# Altium schematic sheet mcu.SchDoc
size A4; SheetNumber: 2; SheetTotal: 7
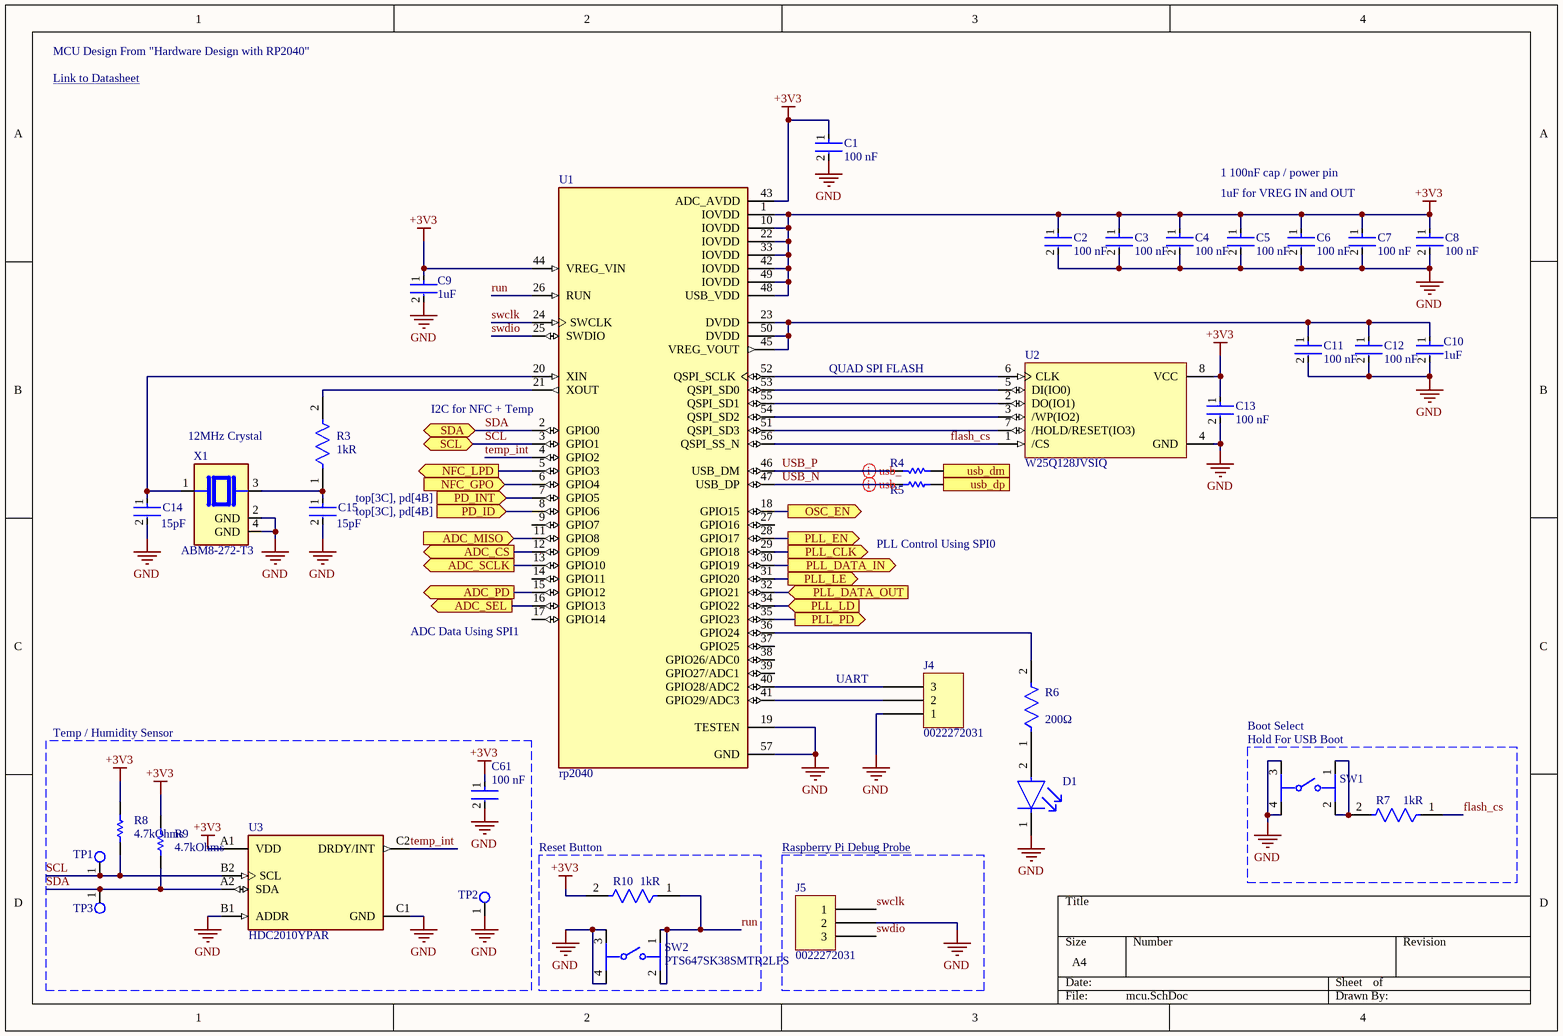
[diagram p0: mcu.SchDoc]

## Parts
C1  Capacitance: 100 nF  [FP-CC0603-DA-MFG]  (hidden comment: CC0603KRX7R7BB104)
C2  Capacitance: 100 nF  [FP-CC0603-DA-MFG]  (hidden comment: CC0603KRX7R7BB104)
C3  Capacitance: 100 nF  [FP-CC0603-DA-MFG]  (hidden comment: CC0603KRX7R7BB104)
C4  Capacitance: 100 nF  [FP-CC0603-DA-MFG]  (hidden comment: CC0603KRX7R7BB104)
C5  Capacitance: 100 nF  [FP-CC0603-DA-MFG]  (hidden comment: CC0603KRX7R7BB104)
C6  Capacitance: 100 nF  [FP-CC0603-DA-MFG]  (hidden comment: CC0603KRX7R7BB104)
C7  Capacitance: 100 nF  [FP-CC0603-DA-MFG]  (hidden comment: CC0603KRX7R7BB104)
C8  Capacitance: 100 nF  [FP-CC0603-DA-MFG]  (hidden comment: CC0603KRX7R7BB104)
C9  Capacitance: 1uF  [FP-CL10-IPC_C]  (hidden comment: CL10B105KP8NNNC)
C10  Capacitance: 1uF  [FP-CL10-IPC_C]  (hidden comment: CL10B105KP8NNNC)
C11  Capacitance: 100 nF  [FP-CC0603-DA-MFG]  (hidden comment: CC0603KRX7R7BB104)
C12  Capacitance: 100 nF  [FP-CC0603-DA-MFG]  (hidden comment: CC0603KRX7R7BB104)
C13  Capacitance: 100 nF  [FP-CC0603-DA-MFG]  (hidden comment: CC0603KRX7R7BB104)
C14  Capacitance: 15pF  [FP-GJM155-0_05-MFG]  (hidden comment: GJM1555C1H150GB01D)
C15  Capacitance: 15pF  [FP-GJM155-0_05-MFG]  (hidden comment: GJM1555C1H150GB01D)
C61  Capacitance: 100 nF  [FP-CC0603-DA-MFG]  (hidden comment: CC0603KRX7R7BB104)
D1  LTST-C190KRKT  [FP-LTST-C190KRKT-MFG]  (value not drawn)
J4  0022272031  [MOLEX KK 0022272031]
J5  0022272031  [MOLEX KK 0022272031]
R3  Resistance: 1kR  [FP-RC0603-0_55-IPC_C]  (hidden comment: RC0603FR-071KL)
R4  RC0402JR-0727RL  [RESC1005X40X25NL05T10]  (value not drawn)
R5  RC0402JR-0727RL  [RESC1005X40X25NL05T10]  (value not drawn)
R6  value 200Ω  [FP-RT0402-MFG]  (hidden comment: RT0402BRD07200RL)
R7  Resistance: 1kR  [FP-RC0603-0_55-IPC_C]  (hidden comment: RC0603FR-071KL)
R8  Resistance: 4.7kOhms  [RESC1608X55X25LL10T15]  (hidden comment: RC0603FR-074K7L)
R9  Resistance: 4.7kOhms  [RESC1608X55X25LL10T15]  (hidden comment: RC0603FR-074K7L)
R10  Resistance: 1kR  [FP-RC0603-0_55-IPC_C]  (hidden comment: RC0603FR-071KL)
SW1  PTS647SK38SMTR2LFS  [FP-PTS647SK38SMTR2LFS-MFG]  (value not drawn)
SW2  PTS647SK38SMTR2LFS  [FP-PTS647SK38SMTR2LFS-MFG]
TP1  Test Point  [test_point]  (value not drawn)
TP2  Test Point  [test_point]  (value not drawn)
TP3  Test Point  [test_point]  (value not drawn)
U1  rp2040  [QFN40P700X700X90-57N]
U2  W25Q128JVSIQ  [SOIC127P790X216-8N]
U3  HDC2010YPAR  [FP-YPA0006-MFG]
X1  ABM8-272-T3  [XTAL_ABM8-272-T3]

## Blocks framed on the sheet
Temp / Humidity Sensor: C61 R8 R9 TP1-TP3 U3
Reset Button: R10 SW2
Raspberry Pi Debug Probe: J5

## Ports
ADC_CS (out, see top[3C], measurment_iq[4B]), ADC_MISO (in, see top[3C], measurment_iq[4B]), ADC_PD (out, see top[3C], measurment_iq[4C]), ADC_SCLK (out, see top[3C], measurment_iq[4B]), ADC_SEL (out, see top[3C], measurment_iq[4C]), NFC_GPO (in, see top[3C], nfc[3B]), NFC_LPD (out, see top[3C], nfc[2B]), OSC_EN (out, see top[3B], measurment_synth[1B]), PD_ID (in, see top[3C], pd[4B]), PD_INT (in, see top[3C], pd[4B]), PLL_CLK (out, see top[3B], measurment_synth[2C]), PLL_DATA_IN (out, see top[3B], measurment_synth[2C]), PLL_DATA_OUT (in, see top[3B], measurment_synth[3C]), PLL_EN (out, see top[3B], measurment_synth[2B]), PLL_LD (in, see top[3B], measurment_synth[3B]), PLL_LE (out, see top[3B], measurment_synth[2C]), PLL_PD (out, see top[3B], measurment_synth[2B]), SCL (bidir, see top[3C], nfc[1B], pd[2C]), SDA (bidir, see top[3C], nfc[1B], pd[2C]), usb_dm (in, see top[3B]), usb_dp (in, see top[3B])

## Nets
+3V3: C1.1 C2.1 C3.1 C4.1 C5.1 C6.1 C7.1 C8.1 C9.1 C13.1 C61.1 R8.2 R9.2 R10.2 U1.1(IOVDD) U1.10(IOVDD) U1.22(IOVDD) U1.33(IOVDD) U1.42(IOVDD) U1.43(ADC_AVDD) U1.44(VREG_VIN) U1.48(USB_VDD) U1.49(IOVDD) U2.8(VCC) U3.A1(VDD)
GND: C1.2 C2.2 C3.2 C4.2 C5.2 C6.2 C7.2 C8.2 C9.2 C10.2 C11.2 C12.2 C13.2 C14.2 C15.2 C61.2 D1.1(C) J4.1 J5.2 SW1.3 SW1.4 SW2.3 SW2.4 TP2.1 U1.19(TESTEN) U1.57(GND) U2.4(GND) U3.B1(ADDR) U3.C1(GND) X1.2(GND) X1.4(GND)
ADC_CS: U1.12(GPIO9) ; port ADC_CS
ADC_MISO: U1.11(GPIO8) ; port ADC_MISO
ADC_PD: U1.15(GPIO12) ; port ADC_PD
ADC_SCLK: U1.13(GPIO10) ; port ADC_SCLK
ADC_SEL: U1.16(GPIO13) ; port ADC_SEL
flash_cs: R7.1 U1.56(QSPI_SS_N) U2.1(/CS)
NFC_GPO: U1.6(GPIO4) ; port NFC_GPO
NFC_LPD: U1.5(GPIO3) ; port NFC_LPD
OSC_EN: U1.18(GPIO15) ; port OSC_EN
PD_ID: U1.8(GPIO6) ; port PD_ID
PD_INT: U1.7(GPIO5) ; port PD_INT
PLL_CLK: U1.29(GPIO18) ; port PLL_CLK
PLL_DATA_IN: U1.30(GPIO19) ; port PLL_DATA_IN
PLL_DATA_OUT: U1.32(GPIO21) ; port PLL_DATA_OUT
PLL_EN: U1.28(GPIO17) ; port PLL_EN
PLL_LD: U1.34(GPIO22) ; port PLL_LD
PLL_LE: U1.31(GPIO20) ; port PLL_LE
PLL_PD: U1.35(GPIO23) ; port PLL_PD
run: R10.1 SW2.1 SW2.2 U1.26(RUN)
SCL: R8.1 TP1.1 U1.3(GPIO1) U3.B2(SCL) ; port SCL
SDA: R9.1 TP3.1 U1.2(GPIO0) U3.A2(SDA) ; port SDA
swclk: J5.1 U1.24(SWCLK)
swdio: J5.3 U1.25(SWDIO)
temp_int: U1.4(GPIO2) U3.C2(DRDY/INT)
usb_dm: R4.2 ; port usb_dm
usb_dp: R5.2 ; port usb_dp
USB_N: R5.1 U1.47(USB_DP)
USB_P: R4.1 U1.46(USB_DM)
NetC10_1: C10.1 C11.1 C12.1 U1.23(DVDD) U1.45(VREG_VOUT) U1.50(DVDD)
NetC14_1: C14.1 U1.20(XIN) X1.1
NetC15_1: C15.1 R3.1 X1.3
NetD1_2: D1.2(A) R6.1
NetJ4_2: J4.2 U1.41(GPIO29/ADC3)
NetJ4_3: J4.3 U1.40(GPIO28/ADC2)
NetR3_2: R3.2 U1.21(XOUT)
NetR6_2: R6.2 U1.36(GPIO24)
NetR7_2: R7.2 SW1.1 SW1.2
NetU1_51: U1.51(QSPI_SD3) U2.7(/HOLD/RESET(IO3))
NetU1_52: U1.52(QSPI_SCLK) U2.6(CLK)
NetU1_53: U1.53(QSPI_SD0) U2.5(DI(IO0))
NetU1_54: U1.54(QSPI_SD2) U2.3(/WP(IO2))
NetU1_55: U1.55(QSPI_SD1) U2.2(DO(IO1))

Not connected (* = marked no-connect by the designer): U1 9(GPIO7) 14(GPIO11) 17(GPIO14) 27(GPIO16) 37(GPIO25) 38(GPIO26/ADC0) 39(GPIO27/ADC1)

## Layout directives
differential pair: USB_N, USB_P

## Notes on the sheet
- MCU Design From "Hardware Design with RP2040"
- Link to Datasheet <https://datasheets.raspberrypi.com/rp2040/hardware-design-with-rp2040.pdf>
- 1 100nF cap / power pin
- 1uF for VREG IN and OUT
- QUAD SPI FLASH
- 12MHz Crystal
- (near U1) I2C for NFC + Temp
- PLL Control Using SPI0
- (near U1) ADC Data Using SPI1
- UART
- (near SW1) Hold For USB Boot
- Boot Select

## Library data of the parts
C1-C8 C11-C13 C61 = CMP-2000-05002-2: CAP CER 0.1UF 16V X7R 0603; Manufacturer: YAGEO; Tolerance: 0.1; Value: 100 nF; Temperature Coefficient: 15%; Material: Ceramic; Voltage Rating: 16 V; Package: CC0603-DA; ComponentLink2Description: Datasheet; Octopart: https://octopart.com/cc0603krx7r7bb104-yageo-192941; Temperature Range High: +125°C; Digikey Description: CAP CER 0.1UF 16V X7R 0603; Voltage: 16 V; Device Class L2: Capacitors; Height: 0.9mm; Temperature: -55°C to +125°C; Manufacturer Part Number: CC0603KRX7R7BB104; Device Class L1: Passive Components; Device Class L3: Ceramic Capacitors; ComponentLink2URL: http://www.yageo.com/documents/recent/UPY-GPHC_X7R_6.3V-to-50V_18.pdf; Footprint Url: http://www.yageo.com/exep/pages/download/literatures/UPY-C_GEN_24.pdf; RoHS: TRUE; Temperature Range Low: -55°C; Temperature Characteristic: X7R; Lead Free: Yes; Category: Cap; Mouser Description: Multilayer Ceramic Capacitor, CC Series, 0.1 - F, - 10%, X7R, 16 V, 0603 [1608 Metric]; Automotive: No
C9 C10 = CMP-2000-06094-2: Cap Ceramic 1uF 10V X7R ±10% Pad SMD 0603 +125°C T/R; Packaging: Tape and Reel; Depth: 0.8mm; Voltage Rating: 10V; Lead Free: Lead Free; Radiation Hardening: No; Length: 1.6mm; Package Quantity: 1; Mount: Surface Mount; Case/Package: 0603; Max Operating Temperature: 125°C; Case Code (Metric): 1608; Height: 0.8mm; Min Operating Temperature: -55°C; Dielectric: X7R; Contact Plating: Tin; Case Code (Imperial): 0603; Thickness: 0.035inch; Voltage Rating (DC): 10V; Tolerance: 10%; Width: 0.031inch
C14 C15 = CMP-2008-03803-2: Multi-Layer Ceramic Capacitor 15pF C0G  ±2% 0402 Paper T/R; Voltage Rating: 50V; Termination: SMD/SMT; Min Operating Temperature: -55°C; Case Code (Imperial): 0402; Depth: 0.5mm; Case/Package: 0402; Max Operating Temperature: 125°C; Lead Free: Lead Free; Width: 0.02inch; Mount: Surface Mount; Radiation Hardening: No; Case Code (Metric): 1005; Length: 1mm; Height: 0.5mm; Package Quantity: 10000; Packaging: Tape and Reel; Voltage Rating (DC): 50V; Tolerance: 2%; Dielectric: C0G; Thickness: 0.022inch
D1 = CMP-1674-00011-2: LED RED CLEAR CHIP SMD; Reverse Voltage: 5V; Viewing Angle: 130°; Power Rating: 75mW; Test Current: 20mA; Number of Elements: 1; Lens Color: Colorless; Wavelength: 639nm; Dominant Wavelength: 631nm; Lens Style: Diffused; Forward Current: 30mA; Forward Voltage: 2.4V; Luminous Intensity: 54mcd; Color: Red; Case Code (Imperial): 0603; Lens Transparency: Clear; Lead Free: Lead Free; Package Quantity: 1; Packaging: Tape and Reel; Max Operating Temperature: 85°C; Number of Pins: 2; Height: 0.8mm; Case/Package: 0603; Number of LEDs: 1; Width: 0.8mm; Case Code (Metric): 1608; Depth: 0.8mm; Mount: Surface Mount; Radiation Hardening: No; Length: 1.6mm; Illumination Color: Red; Power Dissipation: 75mW; Min Operating Temperature: -55°C
J4 J5 = 0022272031: CONN HEADER VERT 3POS 2.54MM; Manufacturer: Molex; Contact Length - Mating: 0.295" (7.49mm); Contact Length - Post: 0.140" (3.56mm); Material Flammability Rating: UL94 V-0; Number of Positions: 3; Number of Positions Loaded: All; Overall Contact Length: 0.560" (14.22mm); Pitch - Mating: 0.100" (2.54mm); Shrouding: Shrouded - 1 Wall; Style: Board to Cable/Wire; Part Number: 0022272031; ComponentLink1Description: Datasheet; ComponentLink1URL: https://www.molex.com/pdm_docs/sd/022272031_sd.pdf; ComponentLink2Description: DigiKey Link; ComponentLink2URL: http://digikey.com/product-detail/en/molex/0022272031/WM4112-ND/1130578; Connector Type: Header; Contact Finish - Mating: Tin; Contact Finish - Post: Tin; Contact Finish Thickness - Mating: 100.0µin (2.54µm); Contact Material: Brass; Contact Shape: Square; Contact Type: Male Pin; Fastening Type: Friction Lock; Insulation Color: Natural; Insulation Height: 0.461" (11.70mm); Insulation Material: Polyamide (PA), Nylon; LastUpdated: 1/12/2020 11:51:54 PM; Lifecycle Status: Active; Minimum Order: 1; Mounting Type: Through Hole; Number of Rows: 1; Packaging: Bulk; PartId: 77; Part Status: Active; Price: 0.37; Series: KK 6410; Supplier 1: DigiKey; Supplier Part Number 1: WM4112-ND; Termination: Solder
R3 R7 R10 = CMP-1659-00009-5: RES 1K OHM 1% 1/10W 0603; Voltage Rating: 50V; Power Rating: 100mW; Temperature Coefficient: 100ppm/°C; Military Standard: Not; REACH SVHC: No SVHC; Size Code: 0603; Features: Moisture Resistant; Number of Terminations: 2; Technology: THICK FILM; Series: RC; Case Code (Metric): 1608; Resistance Tolerance: 1%; Resistor Type: Thick Film; Termination: SMD/SMT; Contact Plating: Tin; Radiation Hardening: No; Min Operating Temperature: -55°C; Max Operating Temperature: 155°C; Packaging: Tape and Reel; Max Power Dissipation: 100mW; RoHS Compliant: Yes; Height: 0.45mm; Lead Free: Lead Free; Case/Package: 0603; Length: 1.6mm; Tolerance: 1%; Case Code (Imperial): 0603; Construction: Rectangular; Depth: 0.8mm
R4 R5 = CMP-1011-00036-2: Manufacturer: Yageo / Phycomp; Part Number: RC0402JR-0727RL
R6 = CMP-03412-023045-1: RES SMD 200 OHM 0.1% 1/16W 0402; Manufacturer: Yageo; Tolerance: 0.001; Voltage Rating: 50V; Temperature Coefficient: 25 ppm/°C; Power Rating: 0.063W; Device Class L2: Resistors; RoHS: TRUE; Series: RT; Resistance: 200Ω; Mouser Description: Thin Film Resistors - SMD 1/16W 200 ohm .1% 25ppm; Manufacturer Part Number: RT0402BRD07200RL; Footprint Url: http://www.yageo.com/exep/pages/download/literatures/PYu-R_Mount_10.pdf; ComponentLink2URL: http://www.yageo.com/documents/recent/PYu-RT_1-to-0.01_RoHS_L_9.pdf; Device Class L1: Passive Components; Height: 0.35mm; Temperature: -55°C to +155°C; Temperature Range High: +155°C; Package: RT0402; Device Class L3: Chip SMD Resistors; Lead Free: Yes; Ipc Land Pattern Name: RESC10050X30; Category: Res; Digikey Description: RES SMD 200 OHM 0.1% 1/16W 0402; Automotive: No; ComponentLink2Description: Datasheet; Composition: Thin Film; Temperature Range Low: -55°C; Octopart: https://octopart.com/rt0402brd07200rl-yageo-1238579
R8 R9 = CMP-2000-06942-1: Chip Resistor, 4.7 KOhm, +/- 1%, 0.1 W, -55 to 155 degC, 0603 (1608 Metric), RoHS, Tape and Reel; Manufacturer: Yageo; Power Rating: 100mW; Temperature Coefficient: 100PPM/C; Voltage Rating: 50V; Package Reference: 0603; Series: RC; Datasheet Version: Rev. 7, 05/2017; Packaging: Reel; Termination Style: SMD/SMT; Datasheet URL: http://www.yageo.com/documents/recent/PYu-RC_Group_51_RoHS_L_7.pdf; Manufacturer URL: http://www.yageo.com/; Package Description: 2-Pin Surface Mount Device, Body 1.6 x 0.8 mm; Case Code - mm: 1608; Case Code - in: 0603; Mounting Technology: SurfaceMount; Operating Temperature Range: -55Cto+155C; Tolerance: 1%; Product: ThickFilmResistorsGeneralPurpose
SW1 SW2 = CMP-10040-000033-1: TACT 4.5 X 4.5, 3.8 MM H, 2.5N,; Switch Function: Off-Mom; Switch Travel: 0.25mm; Actuator Type: Standard; Illumination Type: Non-Illuminated; Mechanical Life: 100000Cycles; Ratings: IP40; Operating Force: 250gf; Throw Configuration: SPST; Max Operating Temperature: 70°C; Min Operating Temperature: -20°C; Termination: Gull Wing; Mount: Surface Mount; Packaging: Tape and Reel
U3 = CMP-04948-000007-1: GEN 2 HUMIDITY SENSOR; Manufacturer: Texas Instruments; Resolution: 14bits; Sensor Output: I2C; Operating Supply Current: 0.105-650uA; Accuracy: 2%; Min Supply Voltage: 1.62V; Max Supply Voltage: 3.6V; Standoff Height: 0.215mm; Digikey Description: GEN 2 HUMIDITY SENSOR; ComponentLink2URL: http://www.ti.com/lit/ds/symlink/hdc2010.pdf; ComponentLink2Description: Datasheet; RoHS: TRUE; Category: IC; Automotive: No; Ipc Land Pattern Name: BGA6N50P2X3_146X146X67; Device Class L1: Sensors; Height: 0.675mm; Mouser Description: Low Power Humidity and Temperature Digital Sensor 6-DSBGA -40 to 85; Package: YPA0006; Manufacturer Part Number: HDC2010YPAR; Temperature: -40°C to +85°C; Device Class L3: unset; Temperature Range High: +85°C; Lead Free: Yes; Interface: I2C; Device Class L2: Temperature and Humidity Sensors; Temperature Range Low: -40°C; Octopart: https://octopart.com/hdc2010ypar-texas+instruments-84791680